# EAGLE design RS232- EIB_Router V1.0 (EAGLE 5.04)
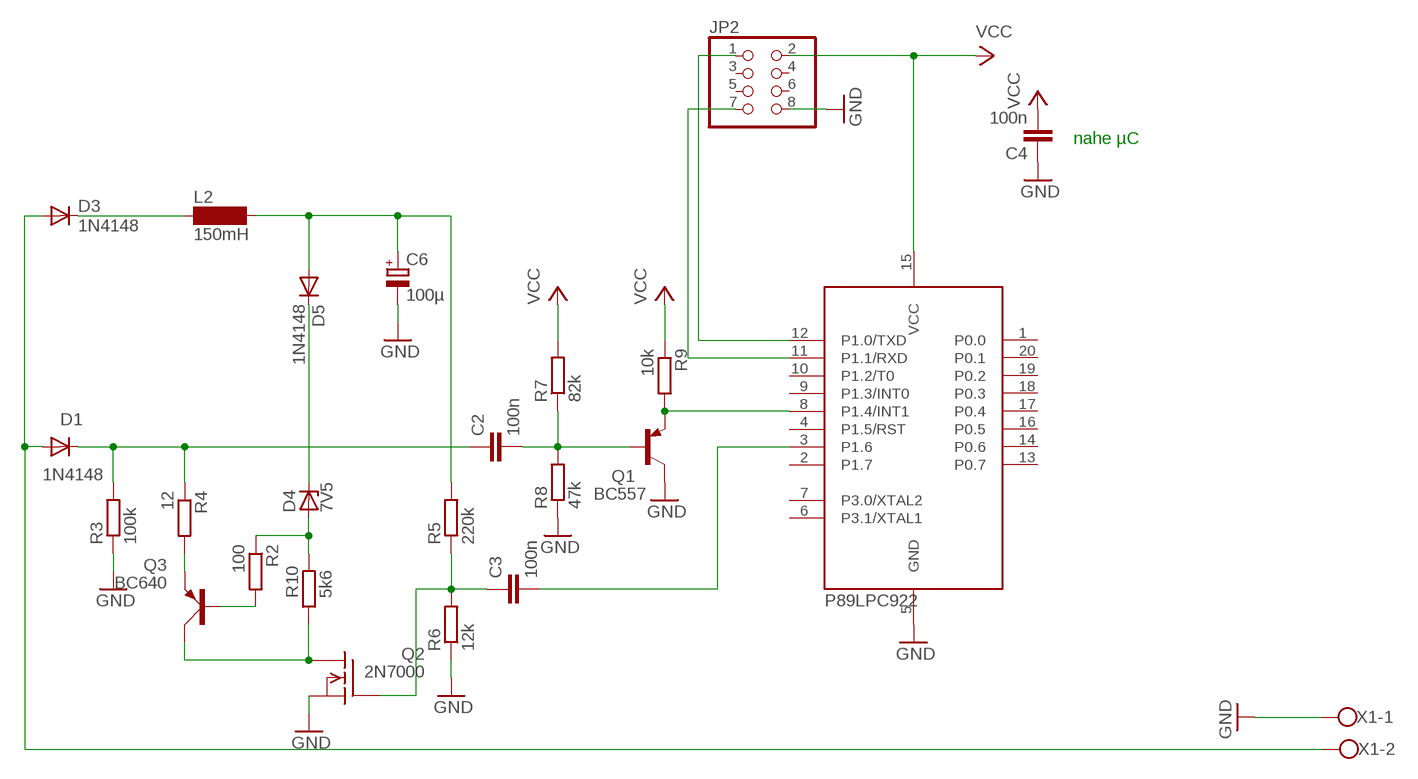
[diagram p0: schematic, sheet 1]

## Parts
C2  100n  C-EU050-024X044  [C050-024X044]
C3  100n  C-EU050-024X044  [C050-024X044]
C4  100n  C-EU050-024X044  [C050-024X044]
C6  100µ  CPOL-EUE5-8.5  [E5-8,5]
D1  1N4148  [DO35-10]
D3  1N4148  [DO35-10]
D4  7V5  ZPD  [DO35Z10]
D5  1N4148  [DO35-10]
JP2  PINHD-2X4  [2X04]
L2  150mH  SD12-1000  [SD12_1000]
Q1  BC557  [TO92]
Q2  2N7000  VN2222KM  [TO237]
Q3  BC640  [SOT54D]
R2  100  R-EU_0207/10  [0207/10]
R3  100k  R-EU_0207/10  [0207/10]
R4  12  R-EU_0207/10  [0207/10]
R5  220k  R-EU_0207/10  [0207/10]
R6  12k  R-EU_0207/10  [0207/10]
R7  82k  R-EU_0207/10  [0207/10]
R8  47k  R-EU_0207/10  [0207/10]
R9  10k  R-EU_0207/10  [0207/10]
R10  5k6  R-EU_0207/10  [0207/10]
U1  89LPC922  [DIL20]
X1  W237-102  [W237-102]

## Nets
GND: C4.1 C6.- JP2.8 Q1.3(C) Q2.3(S) R3.1 R6.1 R8.1 U1.5(GND) X1.1
N$1: Q1.1(E) R9.2 U1.8(P1.4/INT1)
N$2: C2.2 Q1.2(B) R7.1 R8.2
N$3: C6.+ D5.A L2.2 R5.2
N$5: C3.2 U1.3(P1.6)
N$6: Q2.1(D) Q3.C R10.1
N$8: D3.C L2.1
N$9: C2.1 D1.C R3.2 R4.1
N$11: D4.A R2.1 R10.2
N$12: Q3.E R4.2
N$14: Q3.B R2.2
N$16: D1.A D3.A X1.2
N$29: JP2.1 U1.12(P1.0/TXD)
N$30: JP2.7 U1.11(P1.1/RXD)
N$34: C3.1 Q2.2(G) R5.1 R6.2
N$40: D4.C D5.C
VCC: C4.2 JP2.2 R7.2 R9.1 U1.15(VCC)
Unconnected: JP2.3 JP2.4 JP2.5 JP2.6 U1.1(P0.0) U1.2(P1.7) U1.4(P1.5/RST) U1.6(P3.1/XTAL1) U1.7(P3.0/XTAL2) U1.9(P1.3/INT0) U1.10(P1.2/T0) U1.13(P0.7) U1.14(P0.6) U1.16(P0.5) U1.17(P0.4) U1.18(P0.3) U1.19(P0.2) U1.20(P0.1)

## Notes on the sheet
- nahe µC
- P89LPC922

## Library data of the parts
C2-C4 = rcl:C-EU: CAPACITOR, European symbol
C6 = rcl:CPOL-EU: POLARIZED CAPACITOR, European symbol
D1 D3 D5 = diode:1N4148: DIODE high speed (Philips)
D4 = diode:ZPD: Z DIODE 500 mW
JP2 = pinhead:PINHD-2X4: PIN HEADER
L2 = inductor-neosid:SD12: INDUCTOR nominal inductance
Q1 = transistor-pnp:BC557: PNP Transistor
Q2 = transistor-fet:VN2222KM: N-Channel Enhancement MOSFET (VMOS); 60V; 0,5A; 7,5Ohm
Q3 = transistor-small-signal:BC640: PNP TRANSISTOR
R2-R10 = rcl:R-EU_: RESISTOR, European symbol
U1 = micro-philips:89LPC922
X1 = con-wago-500:W237-102: WAGO SCREW CLAMP

## Board
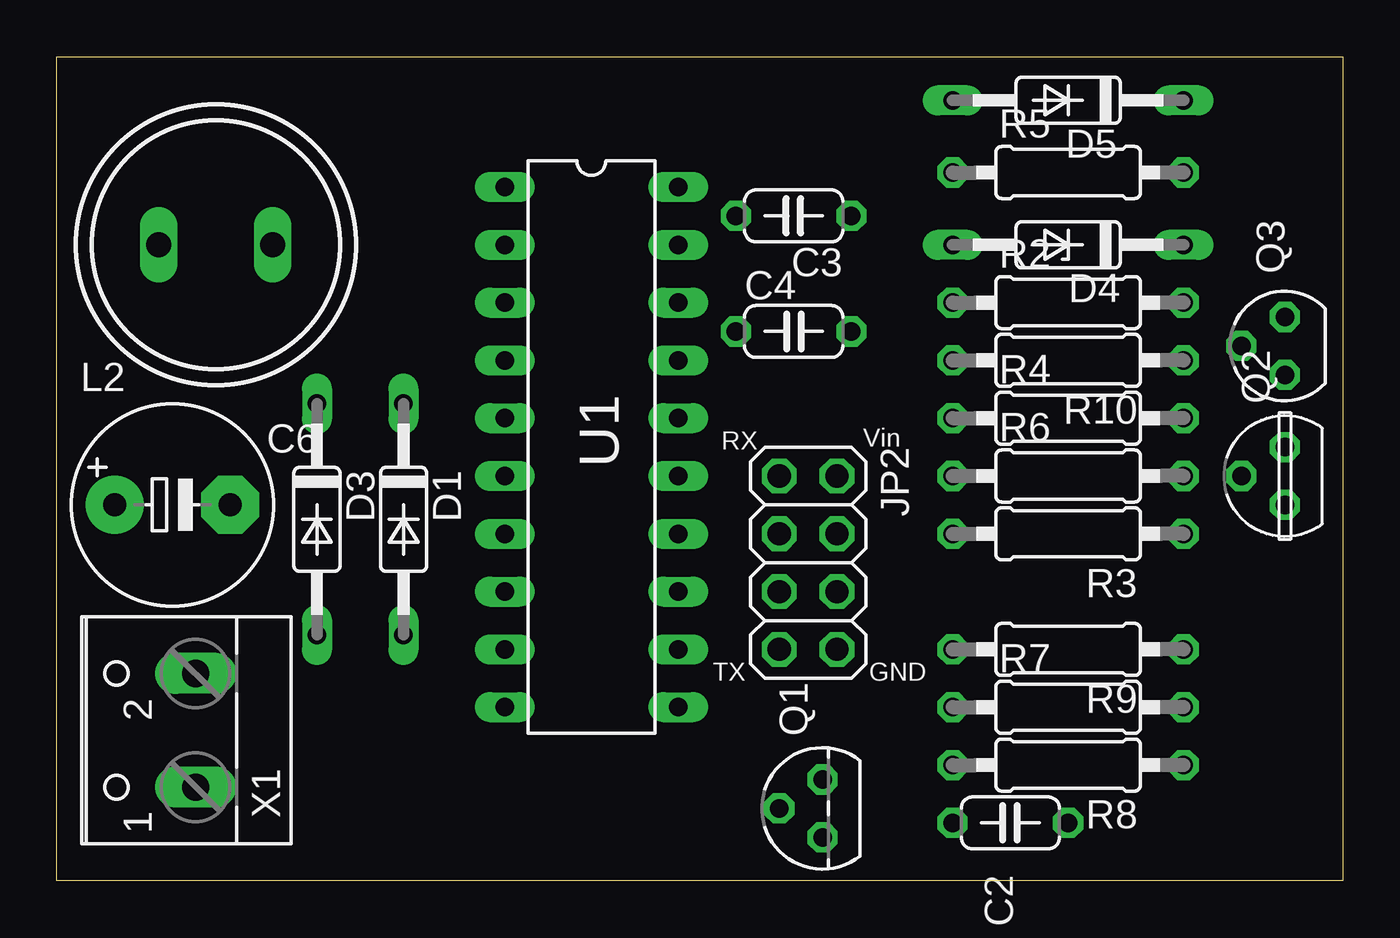
[diagram p1: board, top side]
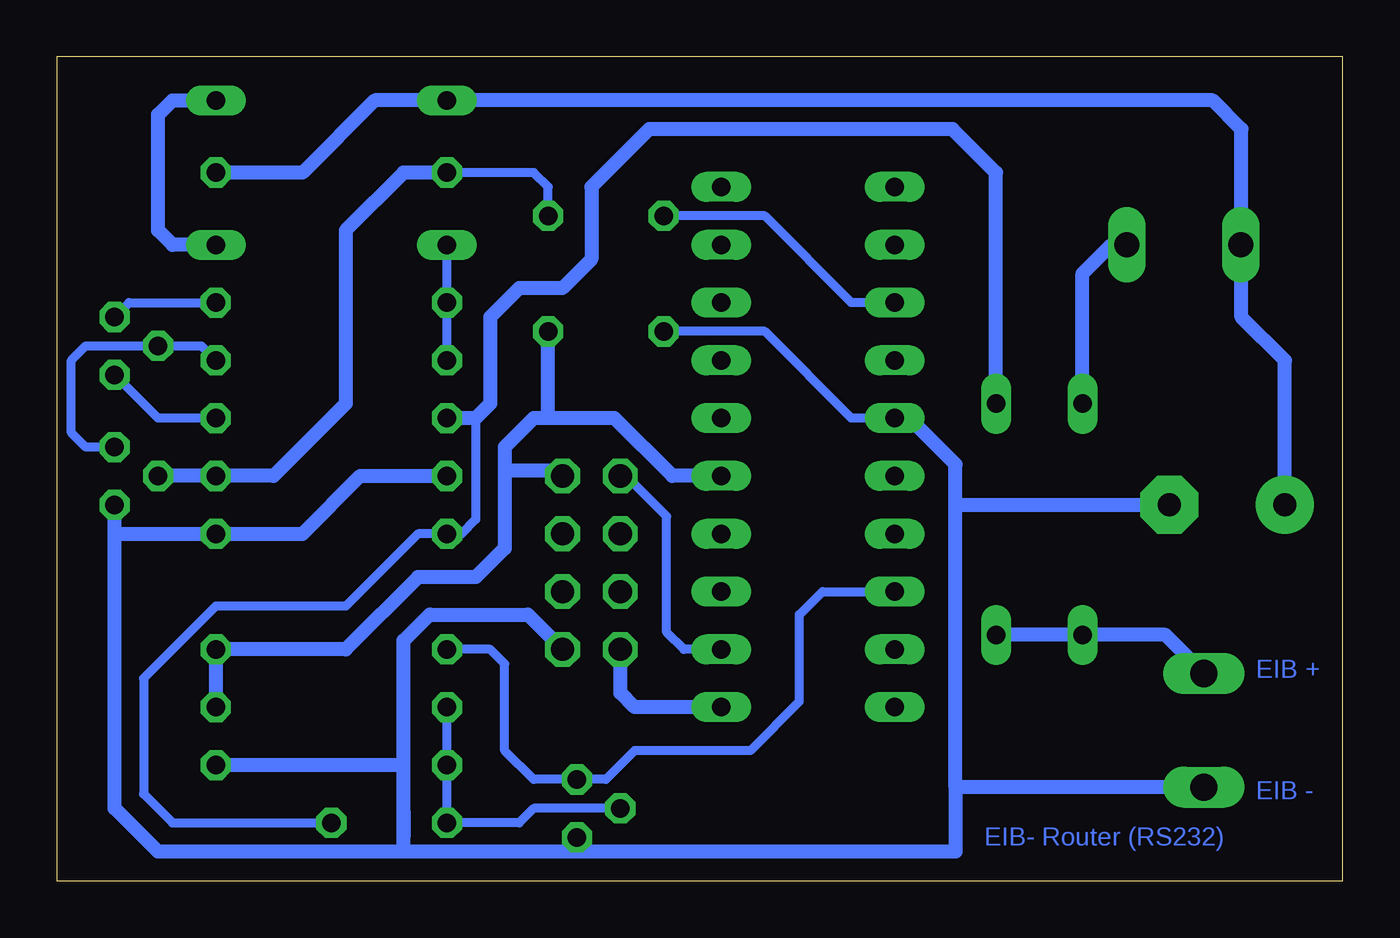
[diagram p2: board, bottom side, seen from below]

Size 56.51 x 36.2 mm. Coordinates in mm from the lower left corner, seen from the top.
Outline: 0,0 0,36.2 56.51,36.2 56.51,0 0,0
Copper layers (1*16): Top 0.035mm / dielectric 1.5mm / Bottom 0.035mm
Design rules "default *": minimum track width 10mil, minimum drill 24mil, track to track 12mil, track to pad 12mil, pad to pad 12mil, via to via 12mil, smd to smd 8mil, copper to edge 20mil, drill to drill 8mil, minimum pad ring 10mil, minimum via ring 8mil, stop-mask expansion 4mil, vias tented up to drill 0mil, thermal gap 10mil

### Footprints (pad centres in the part's own frame; a part is rotated, then mirrored left to right if it is on the bottom)
C050-024X044 = drill 0.813 octagon: 1 -2.54,0; 2 2.54,0
E5-8,5 = drill 1.016 pad 2.54 round: + -2.54,0 | drill 1.016 pad 2.54 octagon: - 2.54,0
DO35-10 = drill 0.813 long: A 5.08,0; C -5.08,0
DO35Z10 = drill 0.813 long: A 5.08,0; C -5.08,0
2X04 = drill 1.016 octagon: 1 -3.81,-1.27; 2 -3.81,1.27; 3 -1.27,-1.27; 4 -1.27,1.27; 5 1.27,-1.27; 6 1.27,1.27; 7 3.81,-1.27; 8 3.81,1.27
SD12_1000 = drill 1.1 long: 1 -2.5,0; 2 2.5,0
TO92 = drill 0.813 octagon: 1 1.27,0; 2 0,1.905; 3 -1.27,0
TO237 = drill 0.813 octagon: 1 1.27,0; 2 0,1.905; 3 -1.27,0
SOT54D = drill 0.813 octagon: B 1.27,0; C 0,1.905; E -1.27,0
0207/10 = drill 0.813 octagon: 1 -5.08,0; 2 5.08,0
DIL20 = drill 0.813 long: 1 -11.43,-3.81; 2 -8.89,-3.81; 3 -6.35,-3.81; 4 -3.81,-3.81; 5 -1.27,-3.81; 6 1.27,-3.81; 7 3.81,-3.81; 8 6.35,-3.81; 9 8.89,-3.81; 10 11.43,-3.81; 11 11.43,3.81; 12 8.89,3.81; 13 6.35,3.81; 14 3.81,3.81; 15 1.27,3.81; 16 -1.27,3.81; 17 -3.81,3.81; 18 -6.35,3.81; 19 -8.89,3.81; 20 -11.43,3.81
W237-102 = drill 1.194 long: 1 -2.5,-1.27; 2 2.5,-1.27

### Placement (x,y rotation side)
C2  41.91,2.54 180 top
C3  32.38,29.21 180 top
C4  32.38,24.13 0 top
C6  5.08,16.51 0 top
D1  15.24,15.88 270 top
D3  11.43,15.88 270 top
D4  44.45,27.94 180 top
D5  44.45,34.29 180 top
JP2  33.02,13.97 270 top
L2  6.99,27.94 180 top
Q1  33.65,3.17 90 top
Q2  53.97,17.78 90 top
Q3  53.97,23.5 90 top
R2  44.45,25.4 0 top
R3  44.45,15.24 180 top
R4  44.45,20.32 0 top
R5  44.45,31.11 0 top
R6  44.45,17.78 0 top
R7  44.45,7.62 0 top
R8  44.45,5.08 180 top
R9  44.45,10.16 180 top
R10  44.45,22.86 180 top
U1  23.5,19.05 270 top
X1  4.83,6.6 90 top

### Tracks (layer width: path | path; a pad name or v marks a point on that pad's centre or on a via)
GND
  Bottom 0.406: U1.5 21.59,20.32 25.4,24.13 C4.1
  Bottom 0.61: 41.27,3.07 41.27,1.91 | 41.27,3.07 41.27,5.08 | 41.27,5.08 41.27,8.89 | 41.27,5.08 R8.1 | R6.1 43.18,17.78 45.72,15.24 R3.1 53.97,15.24 | 53.97,15.24 Q2.3 | 53.97,15.24 53.97,3.17 52.07,1.27 40.64,1.27 | U1.5 19.05,20.32 17.02,18.29 17.02,16.51 | 17.02,16.51 C6.- | 40.64,1.27 41.27,1.27 41.27,3.07 | X1.1 17.02,4.1 | 17.02,4.1 17.02,16.51 | 17.02,4.1 17.02,1.27 33.78,1.27 | 33.78,1.27 40.64,1.27 | Q1.3 33.78,1.78 33.78,1.27 | JP2.8 35.81,11.68 40.13,11.68 41.27,10.54 41.27,8.89 | 41.27,8.89 41.27,10.03
N$1
  Bottom 0.406: U1.8 22.86,12.7 23.88,11.68 23.88,7.87 26.04,5.71 31.11,5.71 32.38,4.45 Q1.1 35.56,4.45 36.83,5.71 36.83,9.53 37.46,10.16 R9.2
N$2
  Bottom 0.406: Q1.2 35.56,3.17 36.2,2.54 C2.2 R8.2 R7.1
N$3
  Bottom 0.61: C6.+ 2.54,22.86 4.45,24.77 4.45,27.94 | R5.2 45.72,31.11 42.54,34.29 D5.A 5.71,34.29 4.45,33.02 4.45,27.94 | 4.45,27.94 L2.2
N$5
  Bottom 0.406: U1.3 21.59,25.4 25.4,29.21 C3.2
N$6
  Bottom 0.406: R10.1 50.16,23.5 Q3.C 55.24,23.5 55.88,22.86 55.88,19.68 55.24,19.05 Q2.1
N$8
  Bottom 0.61: D3.C 11.43,26.67 10.16,27.94 L2.1
N$9
  Bottom 0.406: C2.1 51.43,2.54 52.7,3.81 52.7,8.89 49.53,12.06 43.81,12.06 40.64,15.24 R3.2 38.73,15.24 38.1,15.88 38.1,20.32
  Bottom 0.61: D1.C 15.24,31.11 17.14,33.02 30.48,33.02 33.02,30.48 33.02,27.3 34.29,26.04 36.2,26.04 37.46,24.77 37.46,20.95 38.1,20.32 R4.1
N$11
  Bottom 0.406: D4.A R2.1 R10.2
N$12
  Bottom 0.406: R4.2 52.07,20.32 Q3.E
N$14
  Bottom 0.406: Q3.B 53.34,25.4 R2.2
N$16
  Bottom 0.61: D1.A D3.A 7.79,10.79 X1.2
N$29
  Bottom 0.406: U1.12 28.96,10.16 29.72,10.92 29.72,16 31.5,17.78 JP2.1
N$30
  Bottom 0.61: U1.11 31.11,7.62 31.75,8.26 JP2.7
N$34
  Bottom 0.406: C3.1 34.92,30.48 35.56,31.11 R5.1
  Bottom 0.61: R5.1 41.27,31.11 43.81,28.57 43.81,20.95 46.99,17.78 R6.2 Q2.2
N$40
  Bottom 0.61: D4.C 51.43,27.94 52.07,28.57 52.07,33.66 51.43,34.29 D5.C
VCC
  Bottom 0.61: R7.2 R9.1 43.81,10.16 40.64,13.34 38.1,13.34 36.83,14.61 36.83,18.03 | 36.83,18.03 36.83,19.05 35.56,20.32 34.92,20.32 | 34.92,20.32 C4.2 | 34.92,20.32 32,20.32 29.46,17.78 U1.15 | JP2.2 34.54,18.03 36.83,18.03

### Text on the board
Bottom: EIB + | EIB - | EIB- Router (RS232)
tPlace: RX | Vin | TX | GND